# Altium schematic sheet STM32F401R.SchDoc
size A4
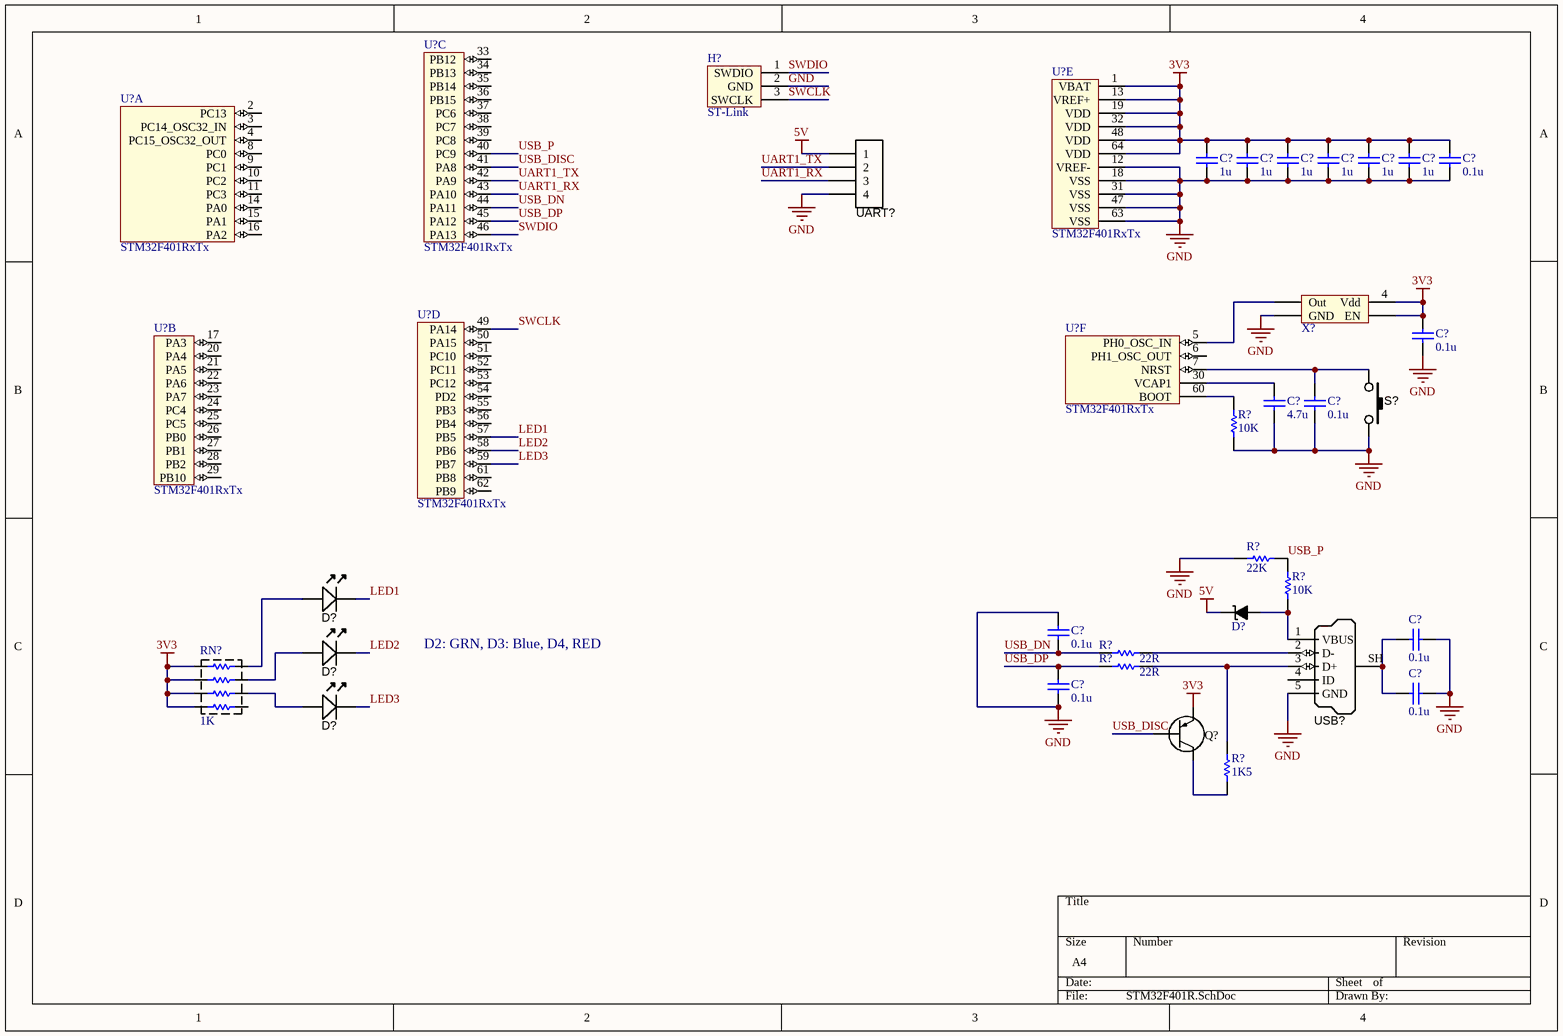
[diagram p0: STM32F401R.SchDoc]

## Parts
(Parts that share a designator on the sheet are numbered #1, #2 ... from top to bottom, then left to right.)
C?#1  value 1u  [CAPC1608X90N]  (hidden comment: Cap)
C?#2  value 1u  [CAPC1608X90N]  (hidden comment: Cap)
C?#3  value 1u  [CAPC1608X90N]  (hidden comment: Cap)
C?#4  value 1u  [CAPC1608X90N]  (hidden comment: Cap)
C?#5  value 1u  [CAPC1608X90N]  (hidden comment: Cap)
C?#6  value 1u  [CAPC1608X90N]  (hidden comment: Cap)
C?#7  value 0.1u  [CAPC1608X90N]  (hidden comment: Cap)
C?#8  value 0.1u  [CAPC1608X90N]  (hidden comment: Cap)
C?#9  value 4.7u  [CAPC1608X90N]  (hidden comment: Cap)
C?#10  value 0.1u  [CAPC1608X90N]  (hidden comment: Cap)
C?#11  value 0.1u  [CAPC1608X90N]  (hidden comment: Cap)
C?#12  value 0.1u  [CAPC1608X90N]  (hidden comment: Cap)
C?#13  value 0.1u  [CAPC1608X90N]  (hidden comment: Cap)
C?#14  value 0.1u  [CAPC1608X90N]  (hidden comment: Cap)
D?#1  LED_Green_GullWing  [LED-0805-A]  (value not drawn)
D?#2  MBRA210LT3G  [SMA]  (value not drawn)
D?#3  LED_Green_GullWing  [LED-0805-A]  (value not drawn)
D?#4  LED_Green_GullWing  [LED-0805-A]  (value not drawn)
H?  ST-Link  [ST-Link]
Q?  DTA114YYUA  [SOT323]  (value not drawn)
R?#1  value 10K  [RESC1608X55N]  (hidden comment: Res1)
R?#2  value 22K  [RESC1608X55N]  (hidden comment: Res1)
R?#3  value 10K  [RESC1608X55N]  (hidden comment: Res1)
R?#4  value 22R  [RESC1608X55N]  (hidden comment: Res1)
R?#5  value 22R  [RESC1608X55N]  (hidden comment: Res1)
R?#6  value 1K5  [RESC1608X55N]  (hidden comment: Res1)
RN?  value 1K  [RESCAXS50P160X320X70-8N]  (hidden comment: resistor network)
S?  SW_THT_PB_4.3mm  [TACT_SWT-SMD-4.4]  (value not drawn)
U?#1  STM32F401RxTx  [LQFP64]  (part C of 6)
U?#2  STM32F401RxTx  [LQFP64]  (part E of 6)
U?#3  STM32F401RxTx  [LQFP64]  (part A of 6)
U?#4  STM32F401RxTx  [LQFP64]  (part D of 6)
U?#5  STM32F401RxTx  [LQFP64]  (part B of 6)
U?#6  STM32F401RxTx  [LQFP64]  (part F of 6)
UART?  Programmer  [HDR1X4_2.54MMP]  (value not drawn)  (no BOM)
USB?  USB Micro Type B  [USB_MICRO-B]  (value not drawn)
X?  ASV-8.000MHZ-EJ-T  [ASV SERIES]  (value not drawn)

## Nets
3V3: C?#1.2 C?#2.2 C?#3.2 C?#4.2 C?#5.2 C?#6.2 C?#7.2 C?#8.2 Q?.2(E) RN?.1 RN?.2 RN?.3 RN?.4 U?#2.1(VBAT) U?#2.13(VREF+) U?#2.19(VDD) U?#2.32(VDD) U?#2.48(VDD) U?#2.64(VDD) X?.1(EN) X?.4(Vdd)
5V: D?#2.K(Cathode) UART?.1
GND: C?#1.1 C?#2.1 C?#3.1 C?#4.1 C?#5.1 C?#6.1 C?#7.1 C?#8.1 C?#9.1 C?#10.1 C?#11.2 C?#12.2 C?#13.2 C?#14.1 H?.2(GND) R?#1.1 R?#2.2 S?.2 U?#2.12(VREF-) U?#2.18(VSS) U?#2.31(VSS) U?#2.47(VSS) U?#2.63(VSS) UART?.4 USB?.5(GND) X?.2(GND)
LED1: D?#1.K U?#4.57(PB5)
LED2: D?#3.K U?#4.58(PB6)
LED3: D?#4.K U?#4.59(PB7)
SWCLK: H?.3(SWCLK) U?#4.49(PA14)
SWDIO: H?.1(SWDIO) U?#1.46(PA13)
UART1_RX: U?#1.43(PA10) UART?.3
UART1_TX: U?#1.42(PA9) UART?.2
USB_DISC: Q?.1(B) U?#1.41(PA8)
USB_DN: C?#12.1 R?#4.1 U?#1.44(PA11)
USB_DP: C?#14.2 R?#5.1 U?#1.45(PA12)
USB_P: R?#2.1 R?#3.2 U?#1.40(PC9)
NetC?#9_2: C?#9.2 U?#6.30(VCAP1)
NetC?#10_2: C?#10.2 S?.1 U?#6.7(NRST)
NetC?#11_1: C?#11.1 C?#13.1 USB?.SH(Shell)
NetD?#1_A: D?#1.A RN?.8
NetD?#2_A: D?#2.A(Anode) R?#3.1 USB?.1(VBUS)
NetD?#3_A: D?#3.A RN?.7
NetD?#4_A: D?#4.A RN?.6
NetQ?_3: Q?.3(C) R?#6.1
NetR?#1_2: R?#1.2 U?#6.60(BOOT)
NetR?#4_2: R?#4.2 USB?.2(D-)
NetR?#5_2: R?#5.2 R?#6.2 USB?.3(D+)
NetU?#6_5: U?#6.5(PH0_OSC_IN) X?.3(Out)

Not connected (* = marked no-connect by the designer): RN? 5; U?#1 33(PB12) 34(PB13) 35(PB14) 36(PB15) 37(PC6) 38(PC7) 39(PC8); U?#3 2(PC13) 3(PC14_OSC32_IN) 4(PC15_OSC32_OUT) 8(PC0) 9(PC1) 10(PC2) 11(PC3) 14(PA0) 15(PA1) 16(PA2); U?#4 50(PA15) 51(PC10) 52(PC11) 53(PC12) 54(PD2) 55(PB3) 56(PB4) 61(PB8) 62(PB9); U?#5 17(PA3) 20(PA4) 21(PA5) 22(PA6) 23(PA7) 24(PC4) 25(PC5) 26(PB0) 27(PB1) 28(PB2) 29(PB10); U?#6 6(PH1_OSC_OUT); USB? 4(ID)

## Notes on the sheet
- D2: GRN, D3: Blue, D4, RED

## Library data of the parts
C?#1-C?#14 = Cap: Capacitor; Published: 8-Jun-2000; LatestRevisionDate: 17-Jul-2002; LatestRevisionNote: Re-released for DXP Platform.; PackageReference: RAD-0.3; Publisher: Altium Limited; PackageDescription: Radial Cap, Thru-Hole; 2 Leads; 0.3 in Pin Spacing
D?#1 D?#3 D?#4 = LED_Green_GullWing: LED Gull-wing SMD High-intensity Green 450mcd 574nm; Manufacturer 1: Ligitek; Manufacturer Part Number 1: L8UG9033/TR1; Ratings: 450 mcd; 574 nm; Material: AlGaInP; SCDType: source; Package / Case: 4.6mm Gull-Wing; Color: Green
D?#2 = MBRA210LT3G: Surface Mount  Schottky Power Rectifier; Manufacturer: ON semiconductor; Vf: 350mV; If: 2A; Vrrm: 10V; datasheet: http://www.mouser.com/ds/2/308/MBRA210LT3-D-76406.pdf
H? = ST-Link: ST-Link header with silkscreen
Q? = DTA114YYUA: PNP -100mA -50V Digital Transistor (Bias Resistor Built-in Transistor); Manufacturer: ROHM
R?#1-R?#6 = Res1: Resistor; Published: 8-Jun-2000; LatestRevisionDate: 17-Jul-2002; LatestRevisionNote: Re-released for DXP Platform.; PackageReference: AXIAL-0.3; Publisher: Altium Limited; PackageDescription: Axial Device, Thru-Hole; 2 Leads; 0.3 in Pin Spacing
RN? = RES_NET
S? = SW_THT_PB_4.3mm: Switch, tact, 4.3mm stem; Manufacturer 1: Bond-Tact; Manufacturer Part Number 1: TS-1143-WP-300; SCDType: spec; Function: Speed; Package / Case: 6.5x6.5mm; 4.3mm stem; Material: Brass/Nylon/Ag plating
UART? = Header4P: Header 4-pin
USB? = USB_Micro_TypeB: Connector SMD USB Micro Type B middle mount; Manufacturer 1: Molex Inc; Manufacturer Part Number 1: 47491-0001; SCDType: undef; Package / Case: SMD; Supplier 1: Digi-Key; Supplier Part Number 1: WM17142CT-ND
X? = ASV-8.000MHZ-EJ-T: 3.3Vdc HCMOS SMD Crystal Clock Oscillator; Manufacturer: Abracon; VDD: 3.3V; Frequency: 8.000MHz